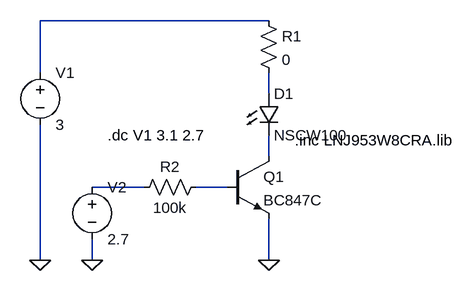
[diagram p0: schematic led_outputs.asc]
led_outputs.asc, the LTspice schematic file:
Version 4
SHEET 1 880 680
WIRE 160 144 -192 144
WIRE -192 224 -192 144
WIRE 160 256 160 224
WIRE 160 352 160 320
WIRE -32 400 -112 400
WIRE 96 400 48 400
WIRE -192 512 -192 304
WIRE -112 512 -112 480
WIRE 160 512 160 448
FLAG 160 512 0
FLAG -112 512 0
FLAG -192 512 0
SYMBOL res 144 128 R0
SYMATTR InstName R1
SYMATTR Value 0
SYMBOL LED 144 256 R0
SYMATTR InstName D1
SYMATTR Value NSCW100
SYMBOL voltage -192 208 R0
SYMATTR InstName V1
SYMATTR Value 3
SYMATTR SpiceLine Rser=20
SYMBOL voltage -112 384 R0
SYMATTR InstName V2
SYMATTR Value 2.7
SYMATTR SpiceLine Rser=10
SYMBOL npn 96 352 R0
SYMATTR InstName Q1
SYMATTR Value BC847C
SYMBOL res 64 384 R90
WINDOW 0 0 56 VBottom 2
WINDOW 3 32 56 VTop 2
SYMATTR InstName R2
SYMATTR Value 100k
TEXT 200 328 Left 2 !.inc LNJ953W8CRA.lib
TEXT -88 320 Left 2 !.dc V1 3.1 2.7

The netlist it stands for:
* led_outputs.asc
R1 N001 N002 0
D1 N002 N003 NSCW100
V1 N001 0 3 Rser=20
V2 N004 0 2.7 Rser=10
Q1 N003 N005 0 0 BC847C
R2 N005 N004 100k
.model D D
.lib standard.dio
.model NPN NPN
.model PNP PNP
.lib standard.bjt
.inc LNJ953W8CRA.lib
.dc V1 3.1 2.7
.backanno
.end